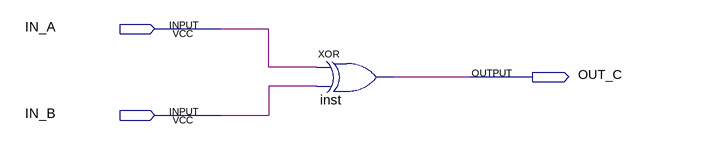
[diagram p0: schematic sheet]
// Quartus schematic compuerta_xor.bdf as structural Verilog: 1 symbols, 3 pins
module compuerta_xor (
  input  IN_A,
  input  IN_B,
  output OUT_C
);

  xor inst (OUT_C, IN_A, IN_B);
endmodule
